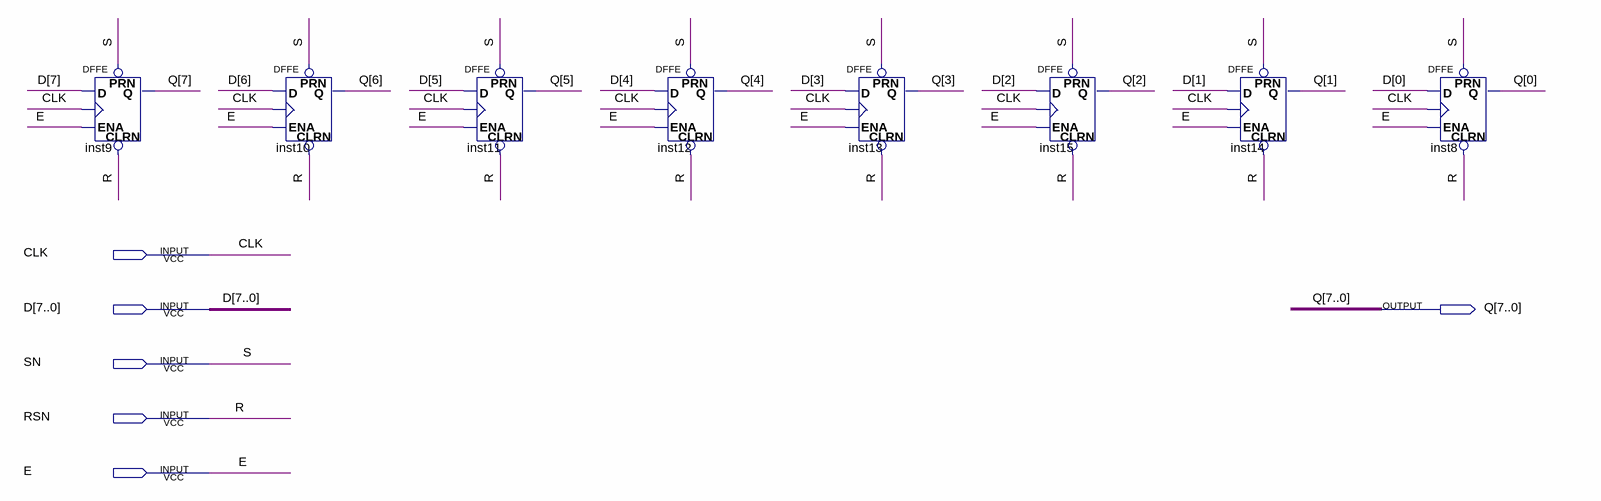
[diagram p0: schematic sheet]
// Quartus schematic REGISTER.bdf as structural Verilog: 8 symbols, 6 pins
module REGISTER (
  input  CLK,
  input  [7:0] D,
  input  SN,
  input  RSN,
  input  E,
  output [7:0] Q
);

  DFFE inst9 (.PRN(SN), .CLRN(RSN), .D(D[7]), .CLK(CLK), .ENA(E), .Q(Q[7]));
  DFFE inst10 (.PRN(SN), .CLRN(RSN), .D(D[6]), .CLK(CLK), .ENA(E), .Q(Q[6]));
  DFFE inst11 (.PRN(SN), .CLRN(RSN), .D(D[5]), .CLK(CLK), .ENA(E), .Q(Q[5]));
  DFFE inst12 (.PRN(SN), .CLRN(RSN), .D(D[4]), .CLK(CLK), .ENA(E), .Q(Q[4]));
  DFFE inst13 (.PRN(SN), .CLRN(RSN), .D(D[3]), .CLK(CLK), .ENA(E), .Q(Q[3]));
  DFFE inst15 (.PRN(SN), .CLRN(RSN), .D(D[2]), .CLK(CLK), .ENA(E), .Q(Q[2]));
  DFFE inst14 (.PRN(SN), .CLRN(RSN), .D(D[1]), .CLK(CLK), .ENA(E), .Q(Q[1]));
  DFFE inst8 (.PRN(SN), .CLRN(RSN), .D(D[0]), .CLK(CLK), .ENA(E), .Q(Q[0]));

  // Other names for the same wires on the sheet: R = RSN; S = SN
endmodule
